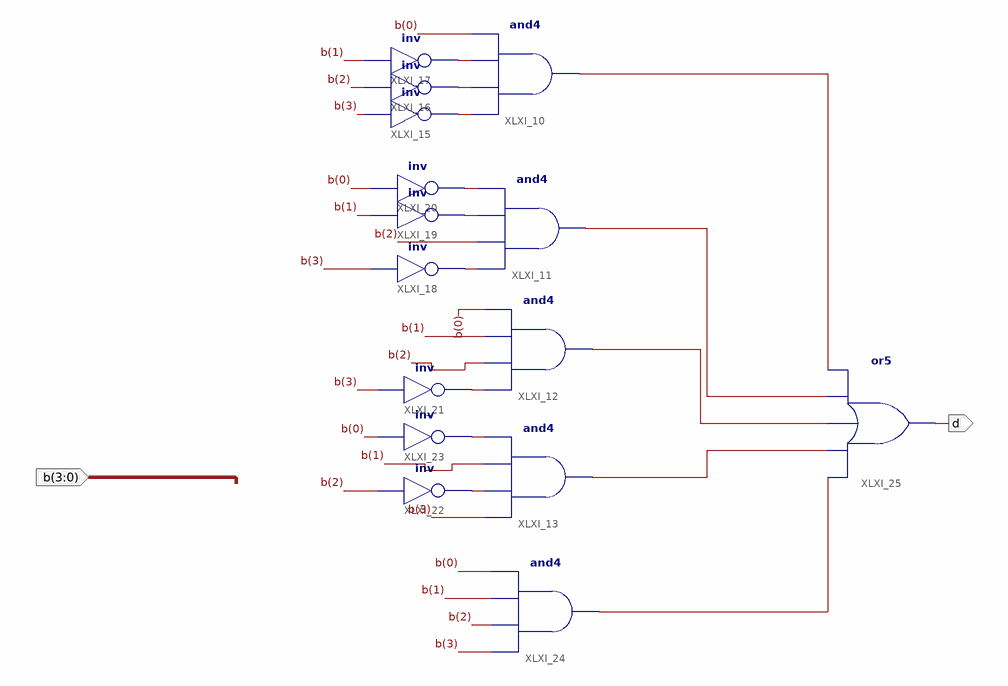
[diagram p0: schematic sheet 1]
// Xilinx ISE schematic d.sch (artix7) as structural Verilog: 15 symbols, 2 ports
module d (
  input  [3:0] b,
  output d
);

  wire XLXN_20, XLXN_21, XLXN_22, XLXN_23, XLXN_24, XLXN_25, XLXN_26, XLXN_27, XLXN_28, XLXN_29, XLXN_31,
       XLXN_32, XLXN_33, XLXN_34;

  and XLXI_10 (XLXN_29, XLXN_20, XLXN_21, XLXN_22, b[0]);
  and XLXI_11 (XLXN_31, XLXN_23, b[2], XLXN_24, XLXN_25);
  and XLXI_12 (XLXN_32, XLXN_26, b[2], b[1], b[0]);
  and XLXI_13 (XLXN_33, b[3], XLXN_27, b[1], XLXN_28);
  not XLXI_15 (XLXN_20, b[3]);
  not XLXI_16 (XLXN_21, b[2]);
  not XLXI_17 (XLXN_22, b[1]);
  not XLXI_18 (XLXN_23, b[3]);
  not XLXI_19 (XLXN_24, b[1]);
  not XLXI_20 (XLXN_25, b[0]);
  not XLXI_21 (XLXN_26, b[3]);
  not XLXI_22 (XLXN_27, b[2]);
  not XLXI_23 (XLXN_28, b[0]);
  and XLXI_24 (XLXN_34, b[3], b[2], b[1], b[0]);
  or XLXI_25 (d, XLXN_34, XLXN_33, XLXN_32, XLXN_31, XLXN_29);
endmodule
